# Altium project EncoderBoard2020.PrjPCB
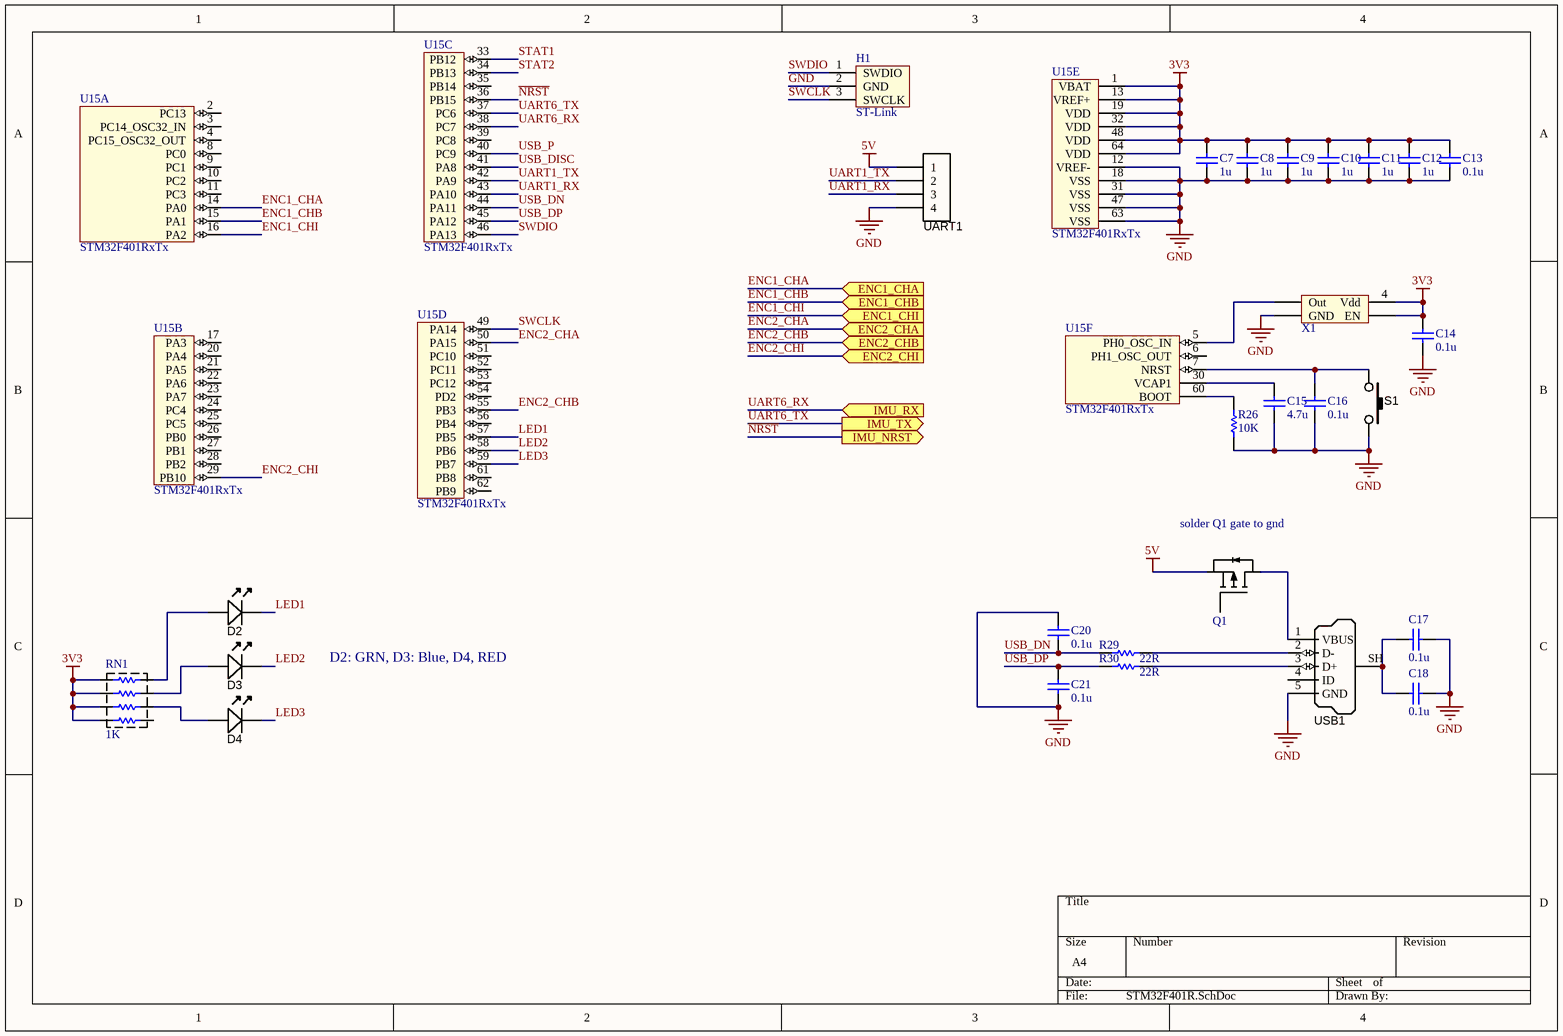
[diagram p0: STM32F401R.SchDoc]
5 sheets, 43 parts. Net scope: hierarchical (ports join the sheet entries above them; power ports are global).
Board files: ENCBoard_rectangle.PcbDoc, pcb1.PcbDoc
Sheets:
  STM32F401R.SchDoc
  EncoderBoard2020.SchDoc
    U_5V_to_3V3 = 5V_to_3V3.SchDoc
    U_EncoderHeader = EncoderHeader.SchDoc
    U_IMU = IMU.SchDoc

## Sheet STM32F401R.SchDoc
size A4

### Parts
C7  value 1u  [CAPC1608X90N]  (hidden comment: Cap)
C8  value 1u  [CAPC1608X90N]  (hidden comment: Cap)
C9  value 1u  [CAPC1608X90N]  (hidden comment: Cap)
C10  value 1u  [CAPC1608X90N]  (hidden comment: Cap)
C11  value 1u  [CAPC1608X90N]  (hidden comment: Cap)
C12  value 1u  [CAPC1608X90N]  (hidden comment: Cap)
C13  value 0.1u  [CAPC1608X90N]  (hidden comment: Cap)
C14  value 0.1u  [CAPC1608X90N]  (hidden comment: Cap)
C15  value 4.7u  [CAPC1608X90N]  (hidden comment: Cap)
C16  value 0.1u  [CAPC1608X90N]  (hidden comment: Cap)
C17  value 0.1u  [CAPC1608X90N]  (hidden comment: Cap)
C18  value 0.1u  [CAPC1608X90N]  (hidden comment: Cap)
C20  value 0.1u  [CAPC1608X90N]  (hidden comment: Cap)
C21  value 0.1u  [CAPC1608X90N]  (hidden comment: Cap)
D2  LED_Green_GullWing  [LED-0805-A]  (value not drawn)
D3  LED_Green_GullWing  [LED-0805-A]  (value not drawn)
D4  LED_Green_GullWing  [LED-0805-A]  (value not drawn)
H1  ST-Link  [ST-Link]
Q1  DMP4010SK3Q  [TO-252]  (value not drawn)
R26  value 10K  [RESC1608X55N]  (hidden comment: Res1)
R29  value 22R  [RESC1608X55N]  (hidden comment: Res1)
R30  value 22R  [RESC1608X55N]  (hidden comment: Res1)
RN1  value 1K  [RESCAXS50P160X320X70-8N]  (hidden comment: resistor network)
S1  SW_THT_PB_4.3mm  [TACT_SWT-SMD-4.4]  (value not drawn)
U15  STM32F401RxTx  [LQFP64]  (parts A,B,C,D,E,F of 6)
UART1  Programmer  [HDR1X4_2.54MMP]  (value not drawn)  (no BOM)
USB1  USB Micro Type B  [USB_MICRO-B]  (value not drawn)
X1  ASV-8.000MHZ-EJ-T  [ASV SERIES]  (value not drawn)

### Ports
ENC1_CHA (in), ENC1_CHB (in), ENC1_CHI (in), ENC2_CHA (in), ENC2_CHB (in), ENC2_CHI (in), IMU_NRST (out), IMU_RX (in), IMU_TX (out)

### Nets
3V3: C7.2 C8.2 C9.2 C10.2 C11.2 C12.2 C13.2 C14.2 RN1.1 RN1.2 RN1.3 RN1.4 U15.1(VBAT) U15.13(VREF+) U15.19(VDD) U15.32(VDD) U15.48(VDD) U15.64(VDD) X1.1(EN) X1.4(Vdd)
5V: Q1.3(S) UART1.1
GND: C7.1 C8.1 C9.1 C10.1 C11.1 C12.1 C13.1 C14.1 C15.1 C16.1 C17.2 C18.2 C20.2 C21.1 H1.2(GND) R26.1 S1.2 U15.12(VREF-) U15.18(VSS) U15.31(VSS) U15.47(VSS) U15.63(VSS) UART1.4 USB1.5(GND) X1.2(GND)
ENC1_CHA: U15.14(PA0) ; port ENC1_CHA
ENC1_CHB: U15.15(PA1) ; port ENC1_CHB
ENC1_CHI: U15.16(PA2) ; port ENC1_CHI
ENC2_CHA: U15.50(PA15) ; port ENC2_CHA
ENC2_CHB: U15.55(PB3) ; port ENC2_CHB
ENC2_CHI: U15.29(PB10) ; port ENC2_CHI
LED1: D2.K U15.57(PB5)
LED2: D3.K U15.58(PB6)
LED3: D4.K U15.59(PB7)
~{NRST}: U15.36(PB15) ; port IMU_NRST
STAT1: U15.33(PB12)
STAT2: U15.34(PB13)
SWCLK: H1.3(SWCLK) U15.49(PA14)
SWDIO: H1.1(SWDIO) U15.46(PA13)
UART1_RX: U15.43(PA10) UART1.3
UART1_TX: U15.42(PA9) UART1.2
UART6_RX: U15.38(PC7) ; port IMU_RX
UART6_TX: U15.37(PC6) ; port IMU_TX
USB_DISC: U15.41(PA8)
USB_DN: C20.1 R29.1 U15.44(PA11)
USB_DP: C21.2 R30.1 U15.45(PA12)
USB_P: U15.40(PC9)
NetC15_2: C15.2 U15.30(VCAP1)
NetC16_2: C16.2 S1.1 U15.7(NRST)
NetC17_1: C17.1 C18.1 USB1.SH(Shell)
NetD2_A: D2.A RN1.8
NetD3_A: D3.A RN1.7
NetD4_A: D4.A RN1.6
NetQ1_4: Q1.4(D) USB1.1(VBUS)
NetR26_2: R26.2 U15.60(BOOT)
NetR29_2: R29.2 USB1.2(D-)
NetR30_2: R30.2 USB1.3(D+)
NetU15_5: U15.5(PH0_OSC_IN) X1.3(Out)

Not connected (* = marked no-connect by the designer): Q1 1(G); RN1 5; U15 2(PC13) 3(PC14_OSC32_IN) 4(PC15_OSC32_OUT) 6(PH1_OSC_OUT) 8(PC0) 9(PC1) 10(PC2) 11(PC3) 17(PA3) 20(PA4) 21(PA5) 22(PA6) 23(PA7) 24(PC4) 25(PC5) 26(PB0) 27(PB1) 28(PB2) 35(PB14) 39(PC8) 51(PC10) 52(PC11) 53(PC12) 54(PD2) 56(PB4) 61(PB8) 62(PB9); USB1 4(ID)

### Notes on the sheet
- (near Q1) solder Q1 gate to gnd
- D2: GRN, D3: Blue, D4, RED

### Library data of the parts
C7-C18 C20 C21 = Cap: Capacitor; Published: 8-Jun-2000; LatestRevisionDate: 17-Jul-2002; LatestRevisionNote: Re-released for DXP Platform.; PackageReference: RAD-0.3; Publisher: Altium Limited; PackageDescription: Radial Cap, Thru-Hole; 2 Leads; 0.3 in Pin Spacing
D2-D4 = LED_Green_GullWing: LED Gull-wing SMD High-intensity Green 450mcd 574nm; Manufacturer 1: Ligitek; Manufacturer Part Number 1: L8UG9033/TR1; Ratings: 450 mcd; 574 nm; Material: AlGaInP; SCDType: source; Package / Case: 4.6mm Gull-Wing; Color: Green
H1 = ST-Link: ST-Link header with silkscreen
R26 R29 R30 = Res1: Resistor; Published: 8-Jun-2000; LatestRevisionDate: 17-Jul-2002; LatestRevisionNote: Re-released for DXP Platform.; PackageReference: AXIAL-0.3; Publisher: Altium Limited; PackageDescription: Axial Device, Thru-Hole; 2 Leads; 0.3 in Pin Spacing
RN1 = RES_NET
S1 = SW_THT_PB_4.3mm: Switch, tact, 4.3mm stem; Manufacturer 1: Bond-Tact; Manufacturer Part Number 1: TS-1143-WP-300; SCDType: spec; Function: Speed; Package / Case: 6.5x6.5mm; 4.3mm stem; Material: Brass/Nylon/Ag plating
UART1 = Header4P: Header 4-pin
USB1 = USB_Micro_TypeB: Connector SMD USB Micro Type B middle mount; Manufacturer 1: Molex Inc; Manufacturer Part Number 1: 47491-0001; SCDType: undef; Package / Case: SMD; Supplier 1: Digi-Key; Supplier Part Number 1: WM17142CT-ND
X1 = ASV-8.000MHZ-EJ-T: 3.3Vdc HCMOS SMD Crystal Clock Oscillator; Manufacturer: Abracon; VDD: 3.3V; Frequency: 8.000MHz

## Sheet EncoderBoard2020.SchDoc
size A4
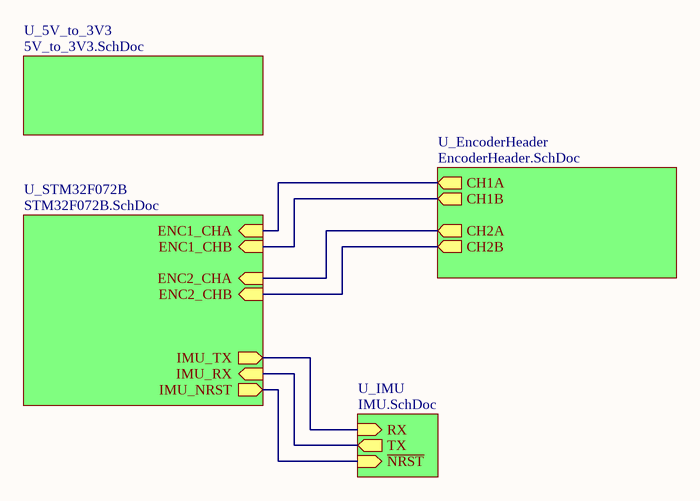
[diagram p1: EncoderBoard2020.SchDoc]

### Sub-sheets
U_5V_to_3V3 = 5V_to_3V3.SchDoc: no entries
U_EncoderHeader = EncoderHeader.SchDoc: CH1B (out), CH1A (out), CH2B (out), CH2A (out)
U_IMU = IMU.SchDoc: TX (out), RX (in), ~{NRST} (in)
U_STM32F072B = STM32F072B.SchDoc (file not in this document): ENC1_CHA (in), ENC1_CHB (in), ENC2_CHA (in), ENC2_CHB (in), IMU_NRST (out), IMU_RX (in), IMU_TX (out)

### Nets
NetENC1_1: sheet U_STM32F072B/ENC1_CHB, sheet U_EncoderHeader/CH1B
NetENC1_3: sheet U_STM32F072B/ENC1_CHA, sheet U_EncoderHeader/CH1A
NetENC2_1: sheet U_STM32F072B/ENC2_CHB, sheet U_EncoderHeader/CH2B
NetENC2_3: sheet U_STM32F072B/ENC2_CHA, sheet U_EncoderHeader/CH2A
NetR4_1: sheet U_STM32F072B/IMU_NRST, sheet U_IMU/~{NRST}
NetU2_13: sheet U_STM32F072B/IMU_TX, sheet U_IMU/RX
NetU2_14: sheet U_STM32F072B/IMU_RX, sheet U_IMU/TX

## Sheet 5V_to_3V3.SchDoc
size A4
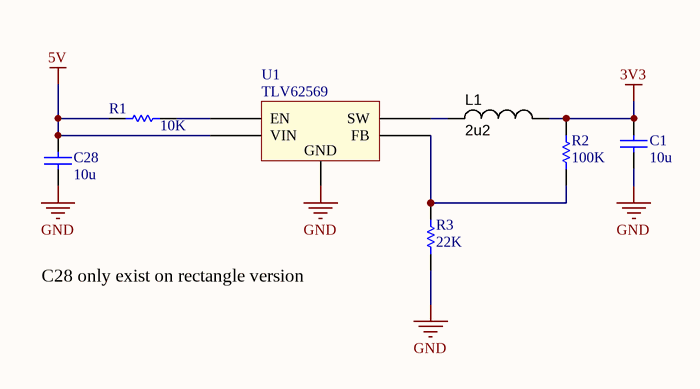
[diagram p2: 5V_to_3V3.SchDoc]

### Parts
C1  value 10u  [CAPC2012X135N]  (hidden comment: Cap)
C28  value 10u  [CAPC2012X135N]  (hidden comment: Cap)
L1  value 2u2  [INDM3225X240N]  (hidden comment: inductor)
R1  value 10K  [RESC1608X55N]  (hidden comment: Res1)
R2  value 100K  [RESC2012X70N]  (hidden comment: Res1)
R3  value 22K  [RESC2012X70N]  (hidden comment: Res1)
U1  TLV62569  [SOT23-5]

### Nets
3V3: C1.2 L1.2 R2.2
5V: C28.2 R1.1 U1.4(VIN)
GND: C1.1 C28.1 R3.2 U1.2(GND)
NetL1_1: L1.1 U1.3(SW)
NetR1_2: R1.2 U1.1(EN)
NetR2_1: R2.1 R3.1 U1.5(FB)

### Notes on the sheet
- C28 only exist on rectangle version

### Library data of the parts
C1 C28 = Cap: Capacitor; Published: 8-Jun-2000; LatestRevisionDate: 17-Jul-2002; LatestRevisionNote: Re-released for DXP Platform.; PackageReference: RAD-0.3; Publisher: Altium Limited; PackageDescription: Radial Cap, Thru-Hole; 2 Leads; 0.3 in Pin Spacing
L1 = INDC: IHLP SMD 4040; link: http://www.mouser.hk/ProductDetail/Panasonic/ETQ-P5M4R7YFC/?qs=sGAEpiMZZMsg%252by3WlYCkUx1BJssUTVH58rrEHsPkNus%3d
R1-R3 = Res1: Resistor; Published: 8-Jun-2000; LatestRevisionDate: 17-Jul-2002; LatestRevisionNote: Re-released for DXP Platform.; PackageReference: AXIAL-0.3; Publisher: Altium Limited; PackageDescription: Axial Device, Thru-Hole; 2 Leads; 0.3 in Pin Spacing
U1 = TLV62569: 2-A High Efficiency Synchronous Buck Converter in SOT Package; Manufacturer: TI; Vin: 2.5-5.5V; Iout(max): 2A

## Sheet EncoderHeader.SchDoc
size A4
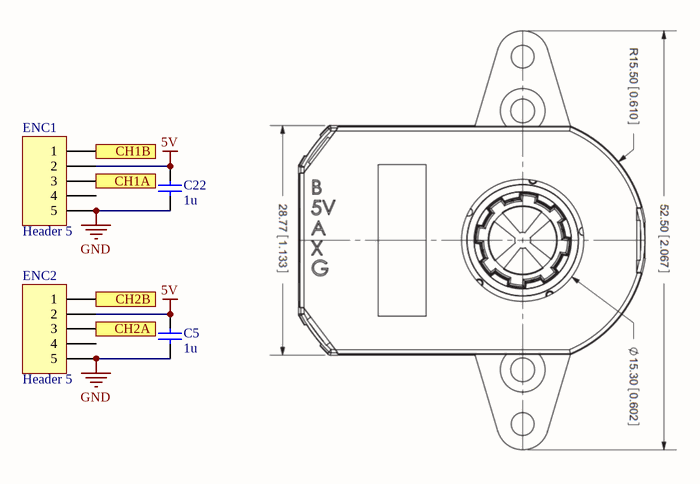
[diagram p3: EncoderHeader.SchDoc]

### Parts
C5  value 1u  [CAPC1608X90N]  (hidden comment: Cap)
C22  value 1u  [CAPC1608X90N]  (hidden comment: Cap)
ENC1  Header 5  [HDR1X5]
ENC2  Header 5  [HDR1X5]

### Ports
CH1A (out), CH1B (out), CH2A (out), CH2B (out)

### Nets
5V: C5.2 C22.2 ENC1.2 ENC2.2
GND: C5.1 C22.1 ENC1.5 ENC2.5
NetENC1_1: ENC1.1 ; port CH1B
NetENC1_3: ENC1.3 ; port CH1A
NetENC2_1: ENC2.1 ; port CH2B
NetENC2_3: ENC2.3 ; port CH2A

Not connected (* = marked no-connect by the designer): ENC1 4; ENC2 4

### Library data of the parts
C5 C22 = Cap: Capacitor; Published: 8-Jun-2000; LatestRevisionDate: 17-Jul-2002; LatestRevisionNote: Re-released for DXP Platform.; PackageReference: RAD-0.3; Publisher: Altium Limited; PackageDescription: Radial Cap, Thru-Hole; 2 Leads; 0.3 in Pin Spacing
ENC1 ENC2 = Header 5: Header, 5-Pin; LatestRevisionDate: 17-Jul-2002; LatestRevisionNote: Re-released for DXP Platform.; Publisher: Altium Limited

## Sheet IMU.SchDoc
size A4
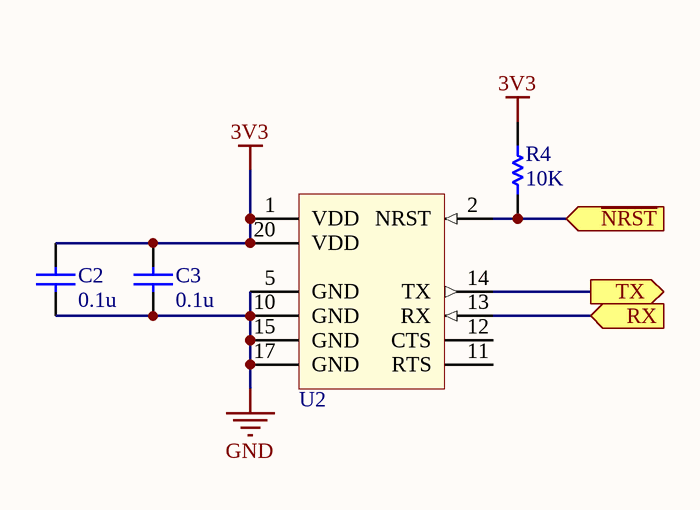
[diagram p4: IMU.SchDoc]

### Parts
C2  value 0.1u  [CAPC1608X90N]  (hidden comment: Cap)
C3  value 0.1u  [CAPC1608X90N]  (hidden comment: Cap)
R4  value 10K  [RESC1608X55N]  (hidden comment: Res1)
U2  LPMS-NAV2  [LPMS-NAV2]  (value not drawn)

### Ports
RX (in), TX (out), ~{NRST} (in)

### Nets
3V3: C2.2 C3.2 R4.2 U2.1(VDD) U2.20(VDD)
GND: C2.1 C3.1 U2.5(GND) U2.10(GND) U2.15(GND) U2.17(GND)
NetR4_1: R4.1 U2.2(NRST) ; port ~{NRST}
NetU2_13: U2.13(RX) ; port RX
NetU2_14: U2.14(TX) ; port TX

Not connected (* = marked no-connect by the designer): U2 11(RTS) 12(CTS)

### Library data of the parts
C2 C3 = Cap: Capacitor; Published: 8-Jun-2000; LatestRevisionDate: 17-Jul-2002; LatestRevisionNote: Re-released for DXP Platform.; PackageReference: RAD-0.3; Publisher: Altium Limited; PackageDescription: Radial Cap, Thru-Hole; 2 Leads; 0.3 in Pin Spacing
R4 = Res1: Resistor; Published: 8-Jun-2000; LatestRevisionDate: 17-Jul-2002; LatestRevisionNote: Re-released for DXP Platform.; PackageReference: AXIAL-0.3; Publisher: Altium Limited; PackageDescription: Axial Device, Thru-Hole; 2 Leads; 0.3 in Pin Spacing
U2 = LPMS-NAV2: ComponentLink1Description: datasheet; ComponentLink1URL: https://www.lp-research.com/wp-content/uploads/2017/11/LPMS-NAV2Manual20171025.pdf; ComponentLink2Description: official website; ComponentLink2URL: https://lp-research.com/lpms-nav2/

## Nets that join several sheets
3V3: STM32F401R (20 pins), 5V_to_3V3 (C1.2 L1.2 R2.2), IMU (5 pins)
5V: STM32F401R (Q1.3 UART1.1), 5V_to_3V3 (C28.2 R1.1 U1.4), EncoderHeader (C5.2 C22.2 ENC1.2 ENC2.2)
GND: STM32F401R (25 pins), 5V_to_3V3 (C1.1 C28.1 R3.2 U1.2), EncoderHeader (C5.1 C22.1 ENC1.5 ENC2.5), IMU (6 pins)